# Altium schematic sheet TP_IHM_DRIVERS.SchDoc
size A4
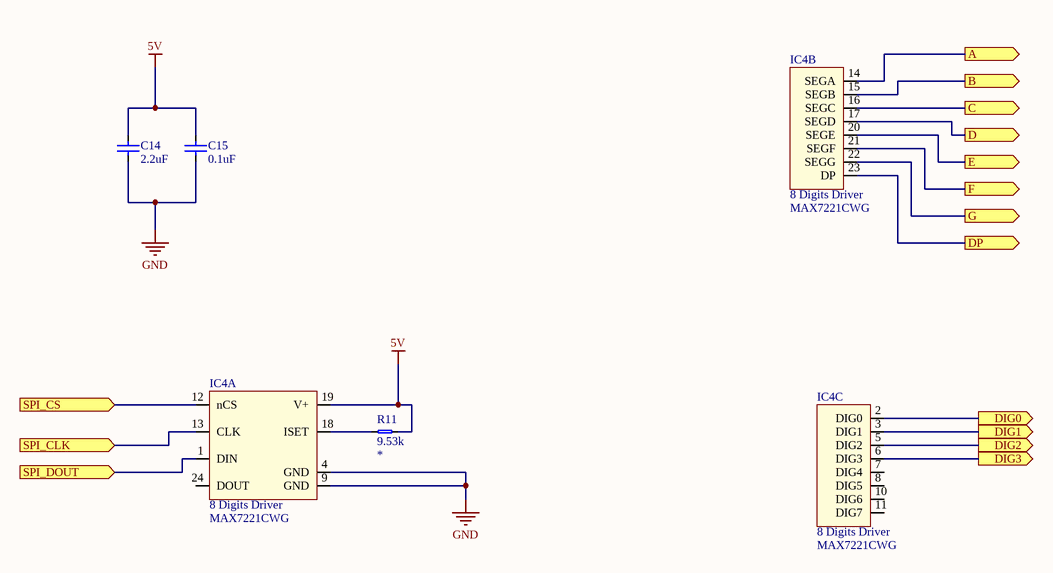
[diagram p0: TP_IHM_DRIVERS.SchDoc]

## Parts
C14  value 2.2uF  [0402_CAP_LD]  (hidden comment: CerCap)
C15  value 0.1uF  [0402_CAP_LD]  (hidden comment: CerCap)
IC4  8 Digits Driver  [MAX7221CWG]  (parts A,B,C of 3)
R11  value 9.53k  [0603_RES_LD]  (hidden comment: Resistor)

## Ports
A (out), B (out), C (out), D (out), DIG0 (out), DIG1 (out), DIG2 (out), DIG3 (out), DP (out), E (out), F (out), G (out), SPI_CLK (in), SPI_CS (in), SPI_DOUT (in)

## Nets
5V: C14.2 C15.2 IC4.19(V+) R11.2
GND: C14.1 C15.1 IC4.4(GND) IC4.9(GND)
A: IC4.14(SEGA) ; port A
B: IC4.15(SEGB) ; port B
C: IC4.16(SEGC) ; port C
D: IC4.17(SEGD) ; port D
DIG0: IC4.2(DIG0) ; port DIG0
DIG1: IC4.3(DIG1) ; port DIG1
DIG2: IC4.5(DIG2) ; port DIG2
DIG3: IC4.6(DIG3) ; port DIG3
DP: IC4.23(DP) ; port DP
E: IC4.20(SEGE) ; port E
F: IC4.21(SEGF) ; port F
G: IC4.22(SEGG) ; port G
SPI_CLK: IC4.13(CLK) ; port SPI_CLK
SPI_CS: IC4.12(nCS) ; port SPI_CS
SPI_DOUT: IC4.1(DIN) ; port SPI_DOUT
NetIC4_18: IC4.18(ISET) R11.1

Not connected (* = marked no-connect by the designer): IC4 7(DIG4) 8(DIG5) 10(DIG6) 11(DIG7) 24(DOUT)

## Library data of the parts
C14 C15 = CerCap: Ceramic Capacitor; Type: *; Voltage/Power: *; Package: *
IC4 = MAX7221: MAX7221 8 Digit 7 Segments Display; Reference: MAX7221CWG
R11 = Resistor: Precision: *; Package: *